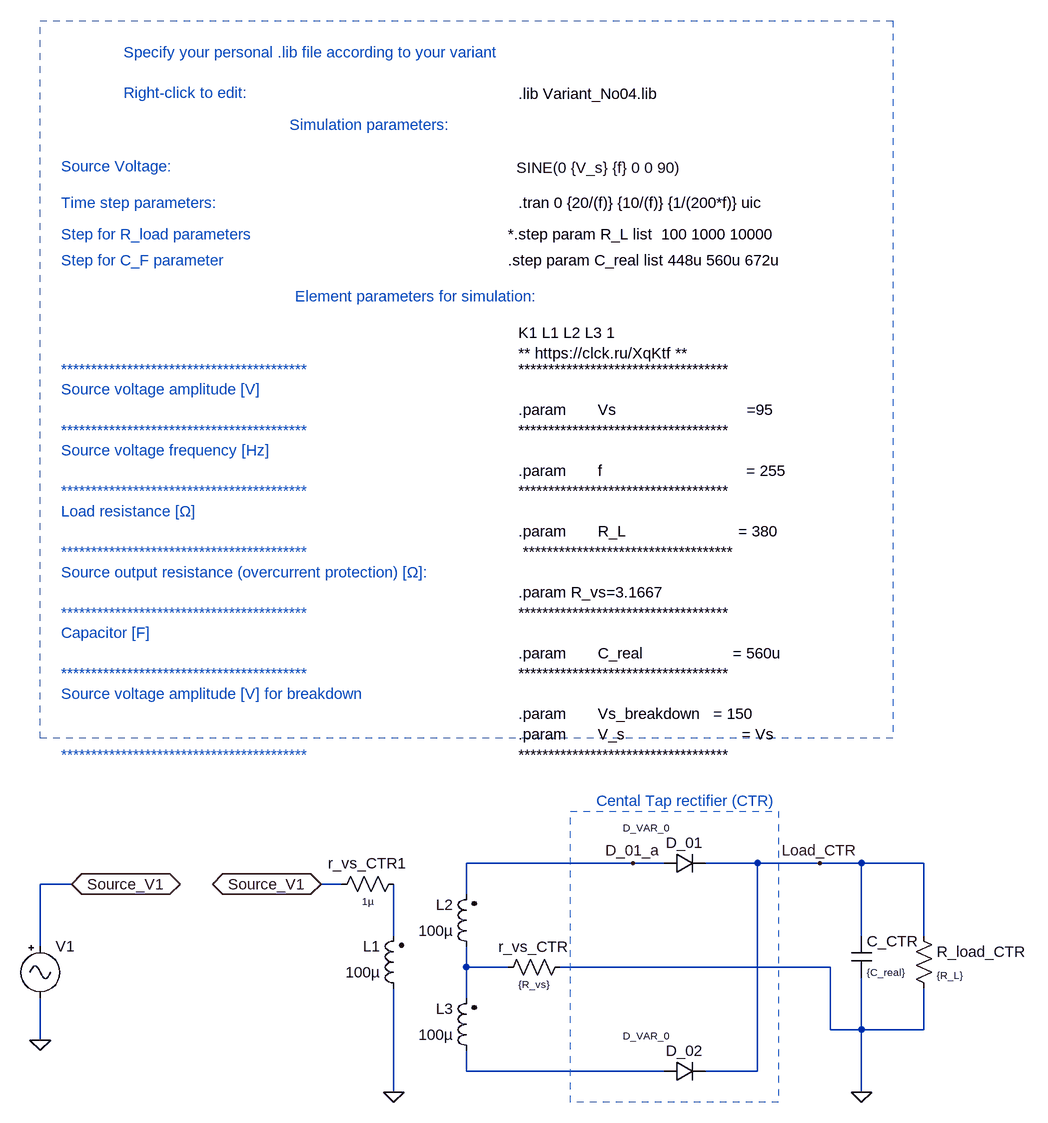
[diagram p0: schematic Lab1_Rectifiers.asc]
Lab1_Rectifiers.asc, the LTspice schematic file:
Version 4
SHEET 1 7368 964
WIRE -656 -288 -912 -288
WIRE -608 -288 -656 -288
WIRE -464 -288 -544 -288
WIRE -368 -288 -464 -288
WIRE -304 -288 -368 -288
WIRE -208 -288 -304 -288
WIRE -1520 -256 -1568 -256
WIRE -1104 -256 -1136 -256
WIRE -912 -240 -912 -288
WIRE -1024 -176 -1024 -256
WIRE -304 -176 -304 -288
WIRE -208 -176 -208 -288
WIRE -1568 -160 -1568 -256
WIRE -912 -128 -912 -160
WIRE -848 -128 -912 -128
WIRE -352 -128 -768 -128
WIRE -912 -80 -912 -128
WIRE -352 -32 -352 -128
WIRE -304 -32 -304 -112
WIRE -304 -32 -352 -32
WIRE -208 -32 -208 -96
WIRE -208 -32 -304 -32
WIRE -1568 -16 -1568 -80
WIRE -912 32 -912 0
WIRE -608 32 -912 32
WIRE -464 32 -464 -288
WIRE -464 32 -544 32
WIRE -1024 64 -1024 -96
WIRE -304 64 -304 -32
FLAG -1568 -16 0
FLAG -1520 -256 Source_V1
IOPIN -1520 -256 BiDir
FLAG -368 -288 Load_CTR
FLAG -304 64 0
FLAG -1136 -256 Source_V1
IOPIN -1136 -256 BiDir
FLAG -1024 64 0
FLAG -656 -288 D_01_a
SYMBOL Misc\\signal -1568 -176 R0
WINDOW 123 0 0 Left 0
WINDOW 39 0 0 Left 0
WINDOW 3 733 -1182 Left 2
SYMATTR Value SINE(0 {V_s} {f} 0 0 90)
SYMATTR InstName V1
SYMBOL ind2 -1008 -80 R180
WINDOW 0 36 80 Left 2
WINDOW 3 36 40 Left 2
SYMATTR InstName L1
SYMATTR Value 100µ
SYMATTR Type ind
SYMBOL ind2 -896 -144 R180
WINDOW 0 36 80 Left 2
WINDOW 3 36 40 Left 2
SYMATTR InstName L2
SYMATTR Value 100µ
SYMATTR Type ind
SYMBOL ind2 -896 16 R180
WINDOW 0 36 80 Left 2
WINDOW 3 36 40 Left 2
SYMATTR InstName L3
SYMATTR Value 100µ
SYMATTR Type ind
SYMBOL diode -608 -272 R270
WINDOW 0 32 32 VTop 2
WINDOW 3 81 -28 VBottom 1
SYMATTR InstName D_01
SYMATTR Value D_VAR_0
SYMBOL diode -608 48 R270
WINDOW 0 32 32 VTop 2
WINDOW 3 81 -28 VBottom 1
SYMATTR InstName D_02
SYMATTR Value D_VAR_0
SYMBOL res -224 -192 R0
WINDOW 3 36 76 Left 1
SYMATTR Value {R_L}
SYMATTR InstName R_load_CTR
SYMATTR SpiceLine tol=5
SYMBOL cap -320 -176 R0
WINDOW 3 24 56 Left 1
SYMATTR Value {C_real}
SYMATTR InstName C_CTR
SYMBOL res -752 -144 R90
WINDOW 0 0 56 VBottom 2
WINDOW 3 32 56 VTop 1
SYMATTR InstName r_vs_CTR
SYMATTR Value {R_vs}
SYMATTR SpiceLine tol=5
SYMBOL res -1008 -272 R90
WINDOW 0 0 56 VBottom 2
WINDOW 3 32 56 VTop 1
SYMATTR InstName r_vs_CTR1
SYMATTR Value 1µ
TEXT -832 -1304 Left 2 !.tran 0 {20/(f)} {10/(f)} {1/(200*f)} uic
TEXT -832 -1472 Left 2 !.lib Variant_No04.lib
TEXT -712 -384 Left 2 ;Cental Tap rectifier (CTR)
TEXT -832 -1104 Left 2 !K1 L1 L2 L3 1\n** https://clck.ru/XqKtf **
TEXT -832 -1048 Left 2 !***********************************\n \n.param       Vs                             =95\n***********************************   \n                                                        \n.param       f                                = 255\n***********************************  \n \n.param       R_L                         = 380\n ***********************************                                                  \n \n.param R_vs=3.1667\n***********************************  \n \n.param       C_real                    = 560u\n***********************************  \n                                                        \n.param       Vs_breakdown   = 150\n.param       V_s                          = Vs\n***********************************
TEXT -848 -1256 Left 2 !*.step param R_L list  100 1000 10000
TEXT -1440 -1536 Left 2 ;Specify your personal .lib file according to your variant\n \nRight-click to edit:
TEXT -1184 -1424 Left 2 ;Simulation parameters:
TEXT -848 -1216 Left 2 !.step param C_real list 448u 560u 672u
TEXT -1536 -1256 Left 2 ;Step for R_load parameters
TEXT -1536 -1216 Left 2 ;Step for C_F parameter
TEXT -1176 -1160 Left 2 ;Element parameters for simulation:
TEXT -1536 -1360 Left 2 ;Source Voltage:
TEXT -1536 -1304 Left 2 ;Time step parameters:
TEXT -1536 -1048 Left 2 ;*****************************************\nSource voltage amplitude [V]\n \n*****************************************\nSource voltage frequency [Hz]\n \n*****************************************\nLoad resistance [Ω]\n \n***************************************** \nSource output resistance (overcurrent protection) [Ω]:\n \n*****************************************\nCapacitor [F]\n \n*****************************************\nSource voltage amplitude [V] for breakdown\n \n \n*****************************************
RECTANGLE Normal -432 80 -752 -368 2
RECTANGLE Normal -256 -480 -1568 -1584 2

The netlist it stands for:
* Lab1_Rectifiers.asc
V1 Source_V1 0 SINE(0 {V_s} {f} 0 0 90)
L1 0 N001 100µ
L2 N002 D_01_a 100µ
L3 N003 N002 100µ
D_01 D_01_a Load_CTR D_VAR_0
D_02 N003 Load_CTR D_VAR_0
R_load_CTR Load_CTR 0 {R_L} tol=5
C_CTR Load_CTR 0 {C_real}
r_vs_CTR 0 N002 {R_vs} tol=5
r_vs_CTR1 N001 Source_V1 1µ
.model D D
.lib standard.dio
.tran 0 {20/(f)} {10/(f)} {1/(200*f)} uic
.lib Variant_No04.lib
* Cental Tap rectifier (CTR)
K1 L1 L2 L3 1
** https://clck.ru/XqKtf **
***********************************
.param       Vs                             =95
***********************************
.param       f                                = 255
***********************************
.param       R_L                         = 380
 ***********************************
.param R_vs=3.1667
***********************************
.param       C_real                    = 560u
***********************************
.param       Vs_breakdown   = 150
.param       V_s                          = Vs
***********************************
*.step param R_L list  100 1000 10000
* Specify your personal .lib file according to your variant
* Right-click to edit:
* Simulation parameters:
.step param C_real list 448u 560u 672u
* Step for R_load parameters
* Step for C_F parameter
* Element parameters for simulation:
* Source Voltage:
* Time step parameters:
* *****************************************
* Source voltage amplitude [V]
* *****************************************
* Source voltage frequency [Hz]
* *****************************************
* Load resistance [Ω]
* *****************************************
* Source output resistance (overcurrent protection) [Ω]:
* *****************************************
* Capacitor [F]
* *****************************************
* Source voltage amplitude [V] for breakdown
* *****************************************
.backanno
.end

* Results of the author's LTspice run, read from the files saved beside the schematic
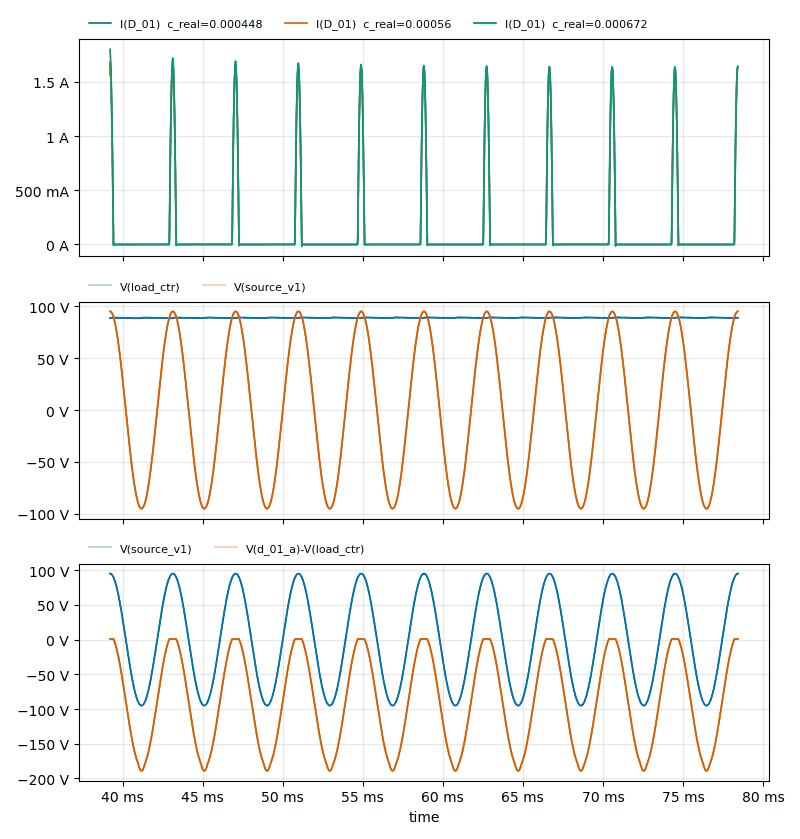
[diagram p1: Transient Analysis of Lab1_Rectifiers.asc, plotted from the saved traces]
* Transient Analysis, 3 runs:
*   I(D_01) [c_real=0.000448]: min -18.3 mA, max 1.645 A, average 116.7 mA, rms 390.5 mA, last 1.639 A
*   I(D_01) [c_real=0.00056]: min -10.88 mA, max 1.687 A, average 117.6 mA, rms 393.1 mA, last 1.64 A
*   I(D_01) [c_real=0.000672]: min -13.02 mA, max 1.801 A, average 119.7 mA, rms 399.1 mA, last 1.643 A
*   V(load_ctr) [c_real=0.000448]: min 88.42 V, max 89.28 V, average 88.87 V, rms 88.87 V, last 88.91 V
*   V(load_ctr) [c_real=0.00056]: min 88.4 V, max 89.2 V, average 88.84 V, rms 88.84 V, last 88.9 V
*   V(load_ctr) [c_real=0.000672]: min 88.24 V, max 89.14 V, average 88.78 V, rms 88.78 V, last 88.89 V
*   V(source_v1) [c_real=0.000448]: min -95 V, max 95 V, average -695 µV, rms 67.2 V, last 95 V
*   V(source_v1) [c_real=0.00056]: min -95 V, max 95 V, average -733.2 µV, rms 67.2 V, last 95 V
*   V(source_v1) [c_real=0.000672]: min -95 V, max 95 V, average -566.6 µV, rms 67.2 V, last 95 V
*   V(source_v1) [c_real=0.000448]: min -95 V, max 95 V, average -695 µV, rms 67.2 V, last 95 V
*   V(source_v1) [c_real=0.00056]: min -95 V, max 95 V, average -733.2 µV, rms 67.2 V, last 95 V
*   V(source_v1) [c_real=0.000672]: min -95 V, max 95 V, average -566.6 µV, rms 67.2 V, last 95 V
*   V(d_01_a)-V(load_ctr) [c_real=0.000448]: min -189 V, max 912 mV, average -89.61 V, rms 112 V, last 909.9 mV
*   V(d_01_a)-V(load_ctr) [c_real=0.00056]: min -189 V, max 914.6 mV, average -89.59 V, rms 112 V, last 910.9 mV
*   V(d_01_a)-V(load_ctr) [c_real=0.000672]: min -189 V, max 921 mV, average -89.54 V, rms 112 V, last 910.8 mV